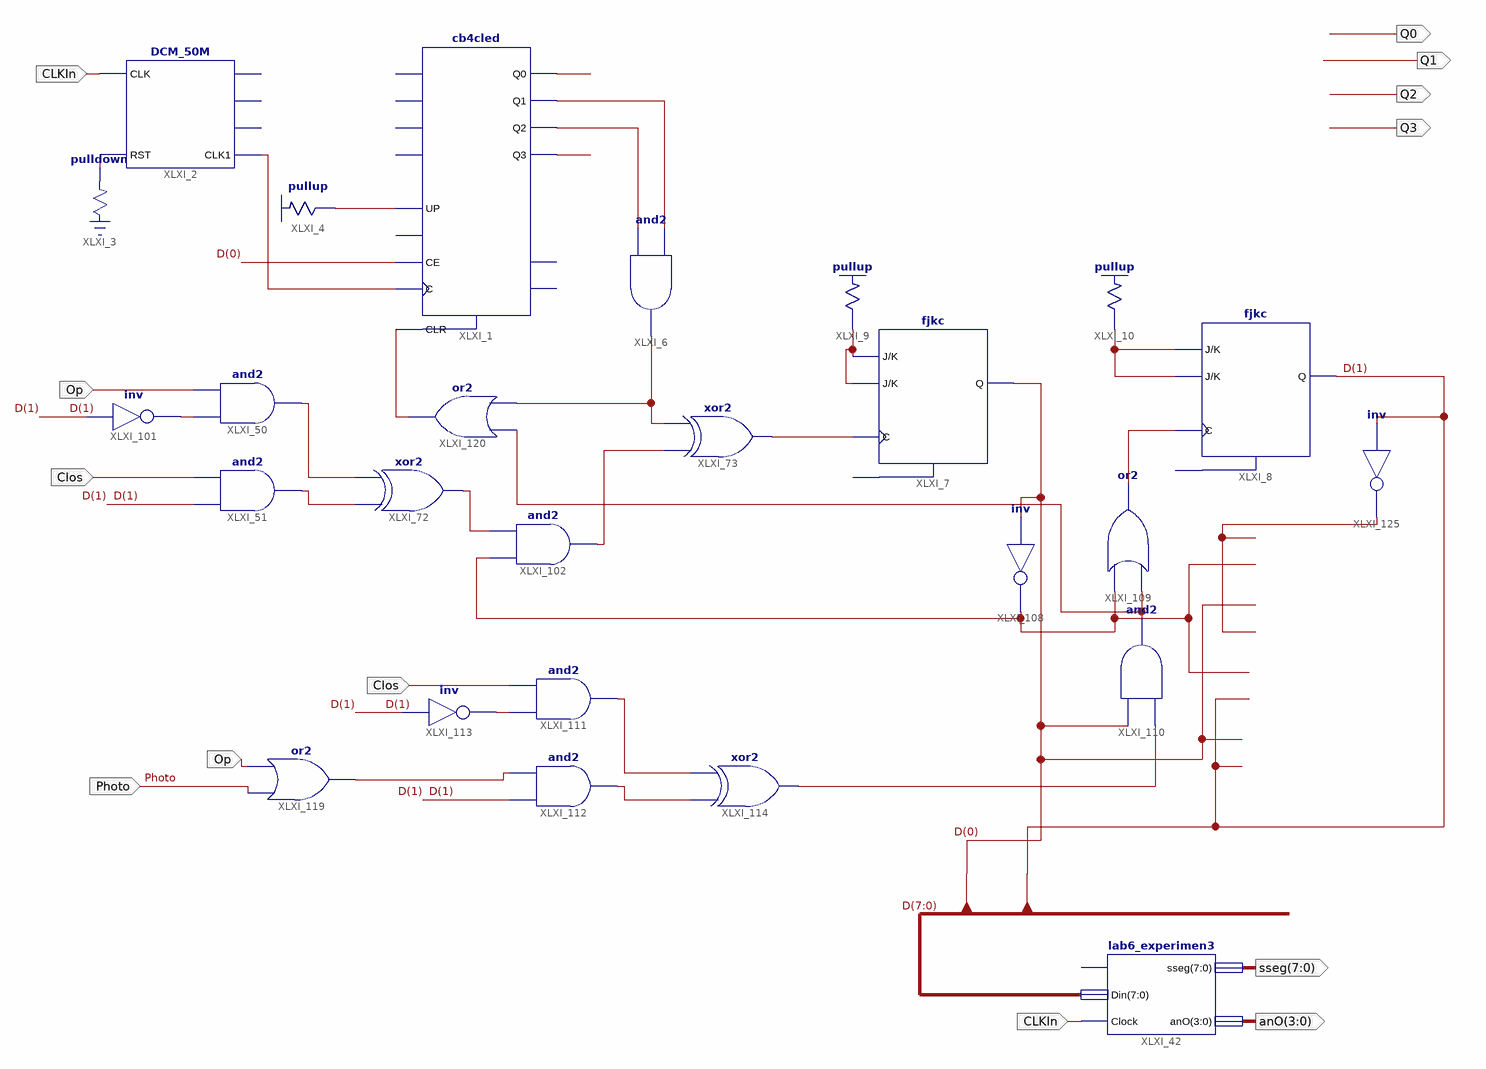
[diagram p0: schematic sheet 1]
// Xilinx ISE schematic lab9_experiment2.sch (spartan3e) as structural Verilog: 26 symbols, 10 ports
module lab9_experiment2 (
  input  CLKIn,
  input  Op,
  input  Clos,
  input  Photo,
  output Q0,
  output Q2,
  output Q3,
  output Q1,
  output [7:0] sseg,
  output [3:0] anO
);

  wire XLXN_4, XLXN_5, XLXN_6, XLXN_31, XLXN_33, XLXN_106, XLXN_116, XLXN_117, XLXN_171, XLXN_183, XLXN_185,
       XLXN_203, XLXN_207, XLXN_210, XLXN_211, XLXN_220, XLXN_223, XLXN_224, XLXN_225, XLXN_226, XLXN_241,
       XLXN_243;
  wire [7:0] D;

  DCM_50M XLXI_2 (.CLK(CLKIn), .RST(XLXN_4), .CLK1(XLXN_6));  // open: CLK1M, CLK10k, CLK1k
  \pulldown  XLXI_3 (.O(XLXN_4));
  \pullup  XLXI_4 (.O(XLXN_5));
  cb4cled XLXI_1 (
    .C(XLXN_6), .CE(D[0]), .CLR(XLXN_226), .UP(XLXN_5), .Q0(Q0), .Q1(Q1), .Q2(Q2), .Q3(Q3));  // open: D0, D1, D2, D3, L, CEO, TC
  \pullup  XLXI_9 (.O(XLXN_31));
  \pullup  XLXI_10 (.O(XLXN_33));
  lab6_experimen3 XLXI_42 (.Din(D), .Clock(CLKIn), .sseg(sseg), .anO(anO));  // open: En
  fjkc XLXI_7 (.C(XLXN_106), .J(XLXN_31), .K(XLXN_31), .Q(D[0]));  // open: CLR
  fjkc XLXI_8 (.C(XLXN_203), .J(XLXN_33), .K(XLXN_33), .Q(D[1]));  // open: CLR
  and XLXI_6 (XLXN_225, Q2, Q1);
  xor XLXI_73 (XLXN_106, XLXN_183, XLXN_225);
  and XLXI_102 (XLXN_183, XLXN_243, XLXN_185);
  and XLXI_50 (XLXN_116, XLXN_171, Op);
  and XLXI_51 (XLXN_117, D[1], Clos);
  not XLXI_101 (XLXN_171, D[1]);
  xor XLXI_72 (XLXN_185, XLXN_117, XLXN_116);
  not XLXI_108 (XLXN_243, D[0]);
  or XLXI_109 (XLXN_203, XLXN_224, XLXN_243);
  and XLXI_110 (XLXN_224, XLXN_220, D[0]);
  and XLXI_111 (XLXN_210, XLXN_207, Clos);
  and XLXI_112 (XLXN_211, D[1], XLXN_223);
  not XLXI_113 (XLXN_207, D[1]);
  xor XLXI_114 (XLXN_220, XLXN_211, XLXN_210);
  or XLXI_119 (XLXN_223, Photo, Op);
  or XLXI_120 (XLXN_226, XLXN_225, XLXN_224);
  not XLXI_125 (XLXN_241, D[1]);
endmodule
